# EAGLE design Plantemoji (EAGLE 9.6.2)
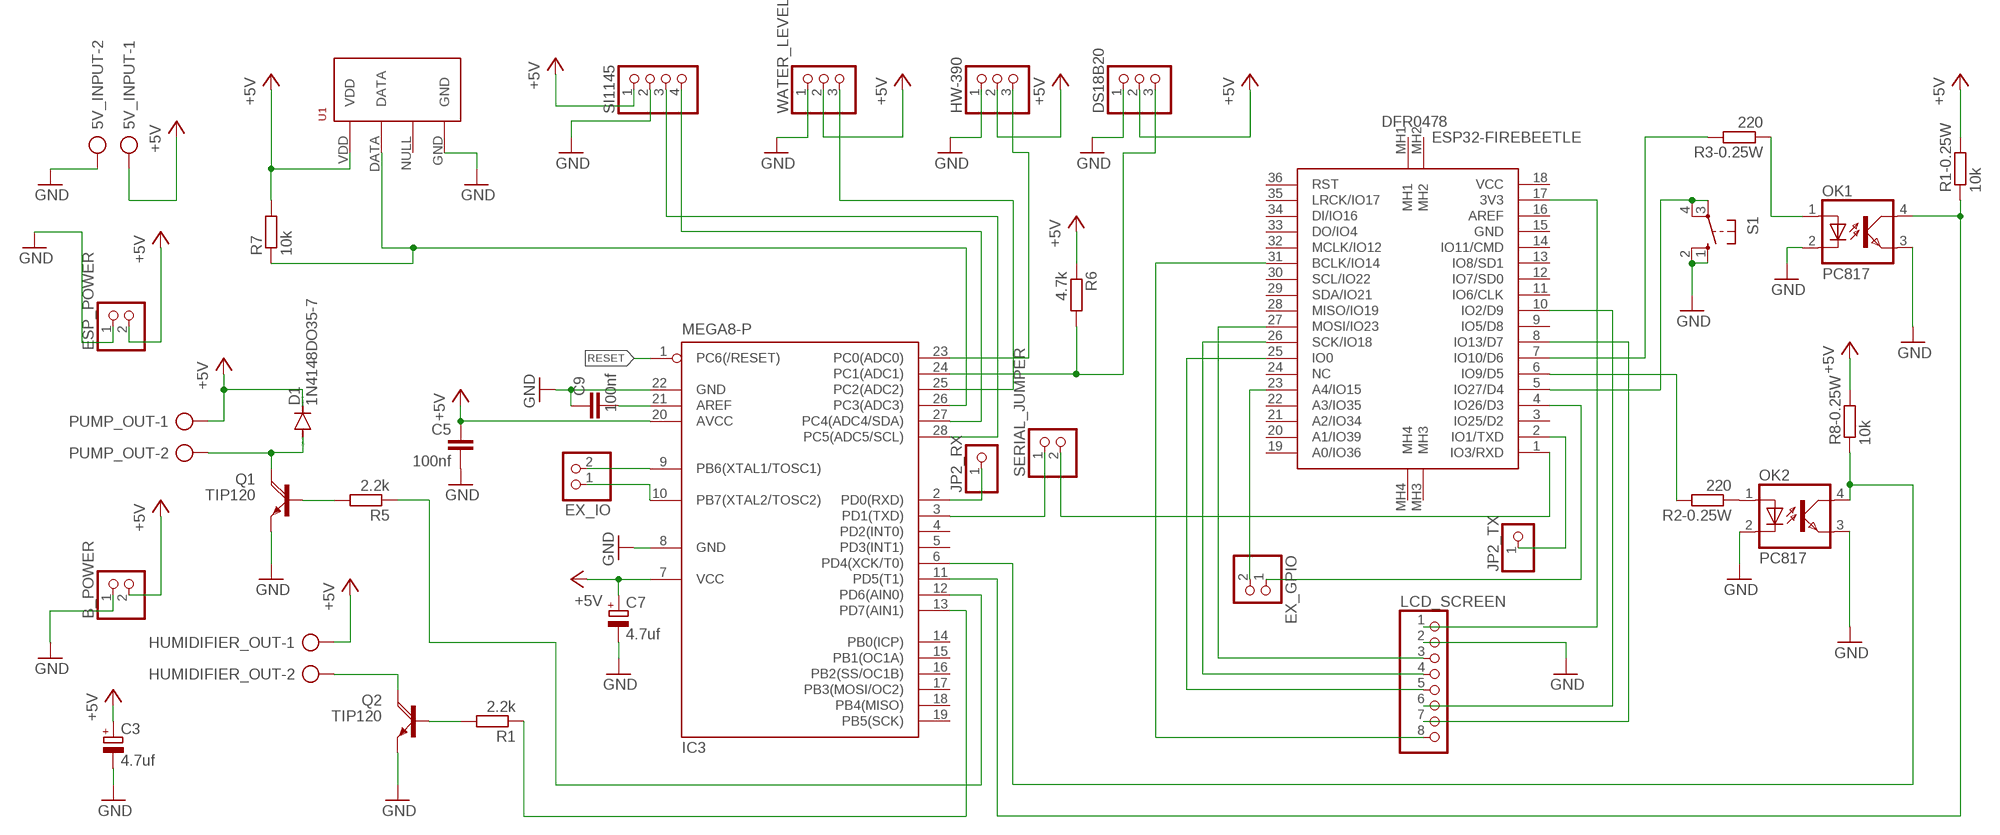
[diagram p0: schematic, sheet 1]

## Parts
5V_INPUT  AK500/2  [AK500/2]
B_POWER  PINHD-1X2  [1X02]
C3  4.7uf  CPOL-EUE2.5-5  [E2,5-5]
C5  100nf  C-EU025-025X050  [C025-025X050]
C7  4.7uf  CPOL-EUE2.5-5  [E2,5-5]
C9  100nf  C-EU025-025X050  [C025-025X050]
D1  1N4148DO35-7  [DO35-7]
DS18B20  PINHD-1X3  [1X03]
ESP32-FIREBEETLE  DFR0478  [FIREBEETLE_ESP32]
ESP_POWER  PINHD-1X2  [1X02]
EX_GPIO  PINHD-1X2  [1X02]
EX_IO  PINHD-1X2  [1X02]
HUMIDIFIER_OUT  AK500/2  [AK500/2]
HW-390  PINHD-1X3  [1X03]
IC3  MEGA8-P  [DIL28-3]
JP2_RX  PINHD-1X1  [1X01]
JP2_TX  PINHD-1X1  [1X01]
LCD_SCREEN  PINHD-1X8  [1X08]
OK1  PC817  [DIL04]
OK2  PC817  [DIL04]
PUMP_OUT  AK500/2  [AK500/2]
Q1  TIP120  [TO220AH]
Q2  TIP120  [TO220AH]
R1  2.2k  R-EU_0207/10  [0207/10]
R1-0.25W  10k  R-EU_0207/10  [0207/10]
R2-0.25W  220  R-EU_0207/10  [0207/10]
R3-0.25W  220  R-EU_0207/10  [0207/10]
R5  2.2k  R-EU_0207/10  [0207/10]
R6  4.7k  R-EU_0207/10  [0207/10]
R7  10k  R-EU_0207/10  [0207/10]
R8-0.25W  10k  R-EU_0207/10  [0207/10]
S1  10-XX  [B3F-10XX]
SERIAL_JUMPER  PINHD-1X2  [1X02]
SI1145  PINHD-1X4  [1X04]
U1  RHT03_DHT-22_AM2302  [RHT03_DHT-22]
WATER_LEVEL  PINHD-1X3  [1X03]

## Nets
+5V: 5V_INPUT.1 B_POWER.2 C3.+ C5.1 C7.+ D1.C DS18B20.2 ESP_POWER.2 HUMIDIFIER_OUT.1 HW-390.2 IC3.7(VCC) IC3.20(AVCC) PUMP_OUT.1 R1-0.25W.2 R6.1 R7.2 R8-0.25W.2 SI1145.1 U1.VDD WATER_LEVEL.2
GND: 5V_INPUT.2 B_POWER.1 C3.- C5.2 C7.- C9.2 DS18B20.1 ESP_POWER.1 HW-390.1 IC3.8(GND) IC3.22(GND) LCD_SCREEN.2 OK1.2(C) OK1.3(EMIT) OK2.2(C) OK2.3(EMIT) Q1.E Q2.E S1.1(S) S1.2(S1) SI1145.2 U1.GND WATER_LEVEL.1
N$2: ESP32-FIREBEETLE.5(IO27/D4) S1.3(P) S1.4(P1)
N$3: IC3.3(PD1(TXD)) SERIAL_JUMPER.1
N$4: ESP32-FIREBEETLE.1(IO3/RXD) SERIAL_JUMPER.2
N$5: ESP32-FIREBEETLE.17(3V3) LCD_SCREEN.1
N$6: ESP32-FIREBEETLE.27(MOSI/IO23) LCD_SCREEN.3
N$7: ESP32-FIREBEETLE.26(SCK/IO18) LCD_SCREEN.4
N$8: ESP32-FIREBEETLE.8(IO13/D7) LCD_SCREEN.7
N$9: ESP32-FIREBEETLE.25(IO0) LCD_SCREEN.5
N$10: ESP32-FIREBEETLE.10(IO2/D9) LCD_SCREEN.6
N$11: IC3.6(PD4(XCK/T0)) OK2.4(COL) R8-0.25W.1
N$12: OK2.1(A) R2-0.25W.1
N$13: ESP32-FIREBEETLE.6(IO9/D5) R2-0.25W.2
N$14: C9.1 IC3.21(AREF)
N$15: OK1.1(A) R3-0.25W.1
N$16: ESP32-FIREBEETLE.7(IO10/D6) R3-0.25W.2
N$17: IC3.2(PD0(RXD)) JP2_RX.1
N$18: ESP32-FIREBEETLE.2(IO1/TXD) JP2_TX.1
N$19: D1.A PUMP_OUT.2 Q1.C
N$20: Q1.B R5.2
N$21: IC3.12(PD6(AIN0)) R5.1
N$22: HUMIDIFIER_OUT.2 Q2.C
N$23: Q2.B R1.2
N$24: IC3.13(PD7(AIN1)) R1.1
N$25: HW-390.3 IC3.23(PC0(ADC0))
N$26: IC3.25(PC2(ADC2)) WATER_LEVEL.3
N$27: DS18B20.3 IC3.24(PC1(ADC1)) R6.2
N$28: IC3.26(PC3(ADC3)) R7.1 U1.DATA
N$29: IC3.28(PC5(ADC5/SCL)) SI1145.3
N$30: IC3.27(PC4(ADC4/SDA)) SI1145.4
N$31: ESP32-FIREBEETLE.31(BCLK/IO14) LCD_SCREEN.8
N$32: ESP32-FIREBEETLE.23(A4/IO15) EX_GPIO.2
N$33: EX_IO.2 IC3.9(PB6(XTAL1/TOSC1))
N$34: EX_IO.1 IC3.10(PB7(XTAL2/TOSC2))
N$35: ESP32-FIREBEETLE.4(IO26/D3) EX_GPIO.1
N$38: IC3.11(PD5(T1)) OK1.4(COL) R1-0.25W.1
RESET: IC3.1(PC6(/RESET))
Unconnected: ESP32-FIREBEETLE.3(IO25/D2) ESP32-FIREBEETLE.9(IO5/D8) ESP32-FIREBEETLE.11(IO6/CLK) ESP32-FIREBEETLE.12(IO7/SD0) ESP32-FIREBEETLE.13(IO8/SD1) ESP32-FIREBEETLE.14(IO11/CMD) ESP32-FIREBEETLE.15(GND) ESP32-FIREBEETLE.16(AREF) ESP32-FIREBEETLE.18(VCC) ESP32-FIREBEETLE.19(A0/IO36) ESP32-FIREBEETLE.20(A1/IO39) ESP32-FIREBEETLE.21(A2/IO34) ESP32-FIREBEETLE.22(A3/IO35) ESP32-FIREBEETLE.24(NC) ESP32-FIREBEETLE.28(MISO/IO19) ESP32-FIREBEETLE.29(SDA/IO21) ESP32-FIREBEETLE.30(SCL/IO22) ESP32-FIREBEETLE.32(MCLK/IO12) ESP32-FIREBEETLE.33(DO/IO4) ESP32-FIREBEETLE.34(DI/IO16) ESP32-FIREBEETLE.35(LRCK/IO17) ESP32-FIREBEETLE.36(RST) ESP32-FIREBEETLE.MH1 ESP32-FIREBEETLE.MH2 ESP32-FIREBEETLE.MH3 ESP32-FIREBEETLE.MH4 IC3.4(PD2(INT0)) IC3.5(PD3(INT1)) IC3.14(PB0(ICP)) IC3.15(PB1(OC1A)) IC3.16(PB2(SS/OC1B)) IC3.17(PB3(MOSI/OC2)) IC3.18(PB4(MISO)) IC3.19(PB5(SCK)) U1.NULL

## Library data of the parts
5V_INPUT HUMIDIFIER_OUT PUMP_OUT = con-ptr500:AK500/2: CONNECTOR; OC_FARNELL: unknown; OC_NEWARK: unknown
B_POWER ESP_POWER EX_GPIO EX_IO SERIAL_JUMPER = pinhead:PINHD-1X2: PIN HEADER
C3 C7 = rcl:CPOL-EU: POLARIZED CAPACITOR, European symbol
C5 C9 = rcl:C-EU: CAPACITOR, European symbol
D1 = diode:1N4148: DIODE high speed (Philips)
DS18B20 HW-390 WATER_LEVEL = pinhead:PINHD-1X3: PIN HEADER
ESP32-FIREBEETLE = DFR0478:DFR0478: Development Boards & Kits - Wireless FireBeetle ESP32 IOT MCU Source: Datasheet <https://datasheet.datasheetarchive.com/originals/distributors/DKDS-1/13356.pdf>; ARROW_PART_NUMBER: DFR0478; ARROW_PRICE-STOCK: https://www.arrow.com/en/products/dfr0478/dfrobot?region=nac; DESCRIPTION: Development Boards & Kits - Wireless FireBeetle ESP32 IOT MCU; HEIGHT: mm; MANUFACTURER_NAME: DFRobot; MANUFACTURER_PART_NUMBER: DFR0478; MOUSER_PART_NUMBER: 426-DFR0478; MOUSER_PRICE-STOCK: https://www.mouser.co.uk/ProductDetail/DFRobot/DFR0478?qs=EU6FO9ffTwc%252BR65h2NUGQw%3D%3D
IC3 = atmel:MEGA8-P: MICROCONTROLLER 8 Kbytes FLASH, 1 kbytes SRAM, 512 bytes EEPROM, USART, 4-channel 10 bit ADC, 2-channel 8 bit ADC Pin compatible with Atmega48, ATMega88, ATMega168 Source: avr.lbr; OC_FARNELL: unknown; OC_NEWARK: unknown
JP2_RX JP2_TX = pinhead:PINHD-1X1: PIN HEADER
LCD_SCREEN = pinhead:PINHD-1X8: PIN HEADER
OK1 OK2 = optocoupler:PC817: SHARP OPTO COUPLER; MPN: PC817X4J000F; OC_FARNELL: 9707727; OC_NEWARK: 97K7059
Q1 Q2 = transistor-power:TIP120: NPN DARLINGTON TRANSISTOR
R1 R1-0.25W R2-0.25W R3-0.25W R5-R7 R8-0.25W = rcl:R-EU_: RESISTOR, European symbol
S1 = switch-omron:10-XX: OMRON SWITCH; MPN: B3F-1000; OC_FARNELL: 176432; OC_NEWARK: 36M3542
SI1145 = pinhead:PINHD-1X4: PIN HEADER
U1 = RHT03_DHT-22_AM2302:RHT03_DHT-22_AM2302: RHT03 / DHT-22 / AM2302 Packages and symbol for the RHT03 / DHT-22 relative humidity and temperature sensor. Note: The AM2302 is a wired version of the DHT-22 which typically requires less clearance and is thus provided as a separate package.; PROD_ID: SEN-10167

## Net classes
0 default: width 0.61 mm, clearance 0.406 mm
1 power: width 1.016 mm, clearance 0.406 mm

## Board
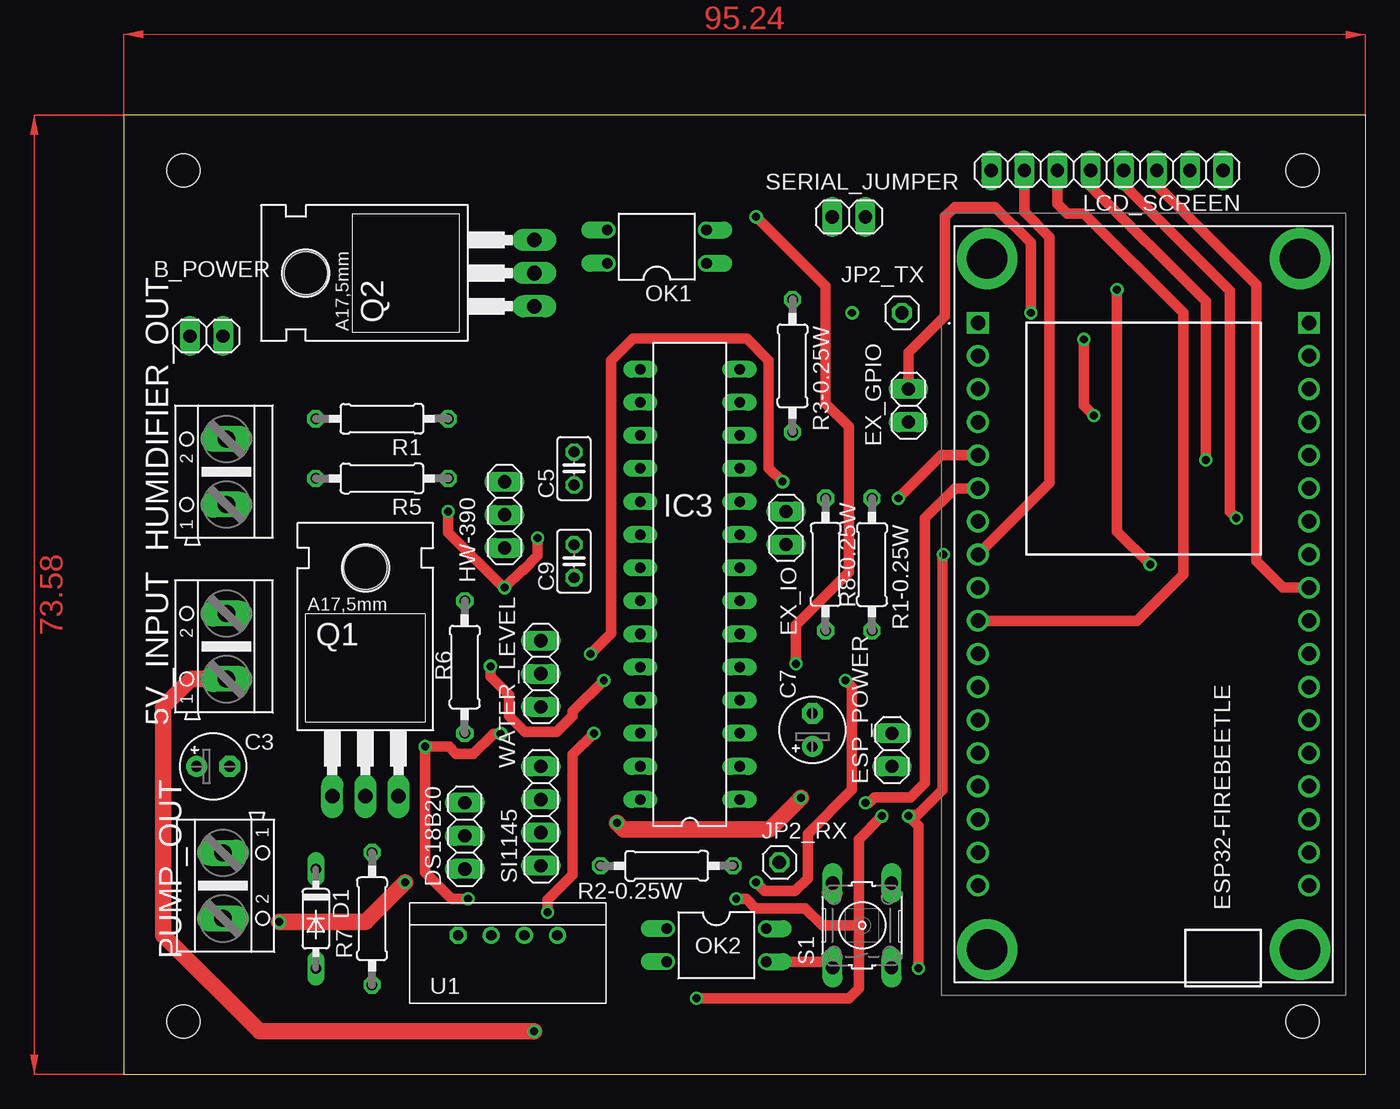
[diagram p1: board, top side]
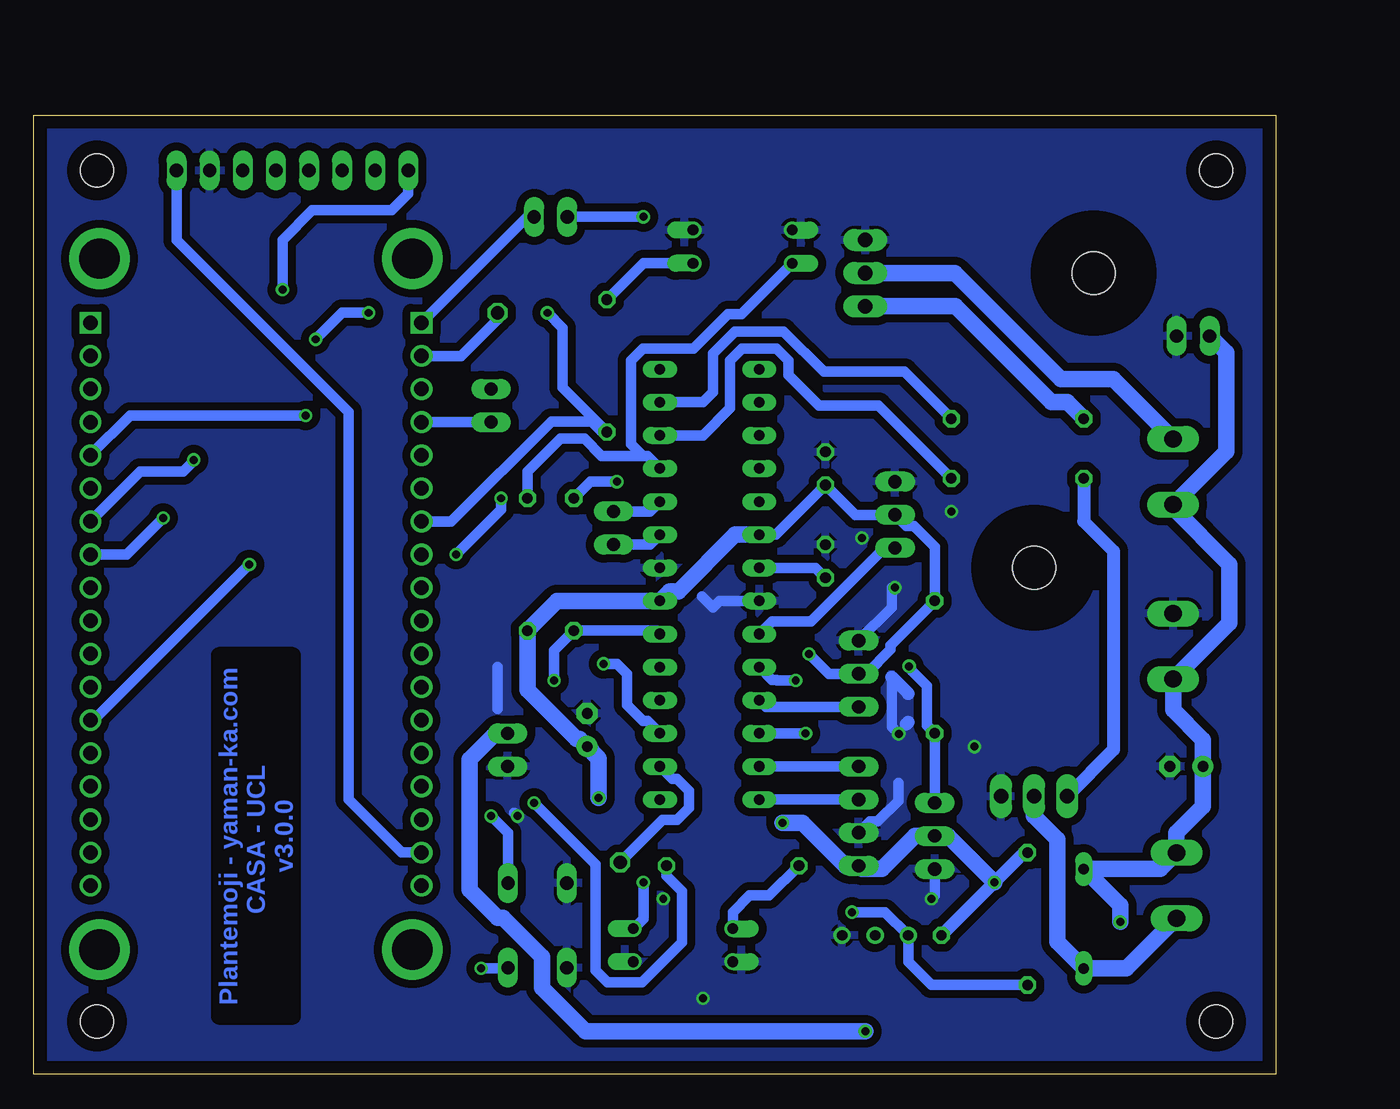
[diagram p2: board, bottom side, seen from below]

Size 95.27 x 73.58 mm. Coordinates in mm from the lower left corner, seen from the top.
Outline: 0,0 95.27,0 95.27,73.58 0,73.58 0,0
Copper layers (1*16): Top 0.035mm / dielectric 1.5mm / Bottom 0.035mm
Design rules "default *": minimum track width 24mil, minimum drill 24mil, track to track 20mil, track to pad 20mil, pad to pad 20mil, via to via 20mil, smd to smd 8mil, copper to edge 40mil, drill to drill 8mil, minimum pad ring 10mil, minimum via ring 8mil, stop-mask expansion 4mil, vias tented up to drill 0mil, thermal gap 10mil
Holes 2.54 mm at 4.57,69.34 4.57,4.06 90.42,4.06 90.42,69.34

### Footprints (pad centres in the part's own frame; a part is rotated, then mirrored left to right if it is on the bottom)
AK500/2 = drill 1.321 long: 1 -2.515,0; 2 2.515,0
1X02 = drill 1.016 long: 1 -1.27,0; 2 1.27,0
E2,5-5 = drill 0.813 pad 1.6: + -1.27,0 | drill 0.813 pad 1.6 octagon: - 1.27,0
C025-025X050 = drill 0.813 octagon: 1 -1.27,0; 2 1.27,0
DO35-7 = drill 0.813 long: A 3.81,0; C -3.81,0
1X03 = drill 1.016 long: 1 -2.54,0; 2 0,0; 3 2.54,0
FIREBEETLE_ESP32 = drill 1.11 pad 1.665 square: 1 25.4,12.7; 19 25.4,-12.7 | drill 1.11 pad 1.665: 2 22.86,12.7; 3 20.32,12.7; 4 17.78,12.7; 5 15.24,12.7; 6 12.7,12.7; 7 10.16,12.7; 8 7.62,12.7; 9 5.08,12.7; 10 2.54,12.7; 11 0,12.7; 12 -2.54,12.7; 13 -5.08,12.7; 14 -7.62,12.7; 15 -10.16,12.7; 16 -12.7,12.7; 17 -15.24,12.7; 18 -17.78,12.7; 20 22.86,-12.7; 21 20.32,-12.7; 22 17.78,-12.7; 23 15.24,-12.7; 24 12.7,-12.7; 25 10.16,-12.7; 26 7.62,-12.7; 27 5.08,-12.7; 28 2.54,-12.7; 29 0,-12.7; 30 -2.54,-12.7; 31 -5.08,-12.7; 32 -7.62,-12.7; 33 -10.16,-12.7; 34 -12.7,-12.7; 35 -15.24,-12.7; 36 -17.78,-12.7 | drill 3.1 pad 4.65: MH1 -22.677,-12; MH2 -22.677,12; MH3 30.323,12; MH4 30.323,-12
DIL28-3 = drill 0.813 long: 1 -16.51,-3.81; 2 -13.97,-3.81; 3 -11.43,-3.81; 4 -8.89,-3.81; 5 -6.35,-3.81; 6 -3.81,-3.81; 7 -1.27,-3.81; 8 1.27,-3.81; 9 3.81,-3.81; 10 6.35,-3.81; 11 8.89,-3.81; 12 11.43,-3.81; 13 13.97,-3.81; 14 16.51,-3.81; 15 16.51,3.81; 16 13.97,3.81; 17 11.43,3.81; 18 8.89,3.81; 19 6.35,3.81; 20 3.81,3.81; 21 1.27,3.81; 22 -1.27,3.81; 23 -3.81,3.81; 24 -6.35,3.81; 25 -8.89,3.81; 26 -11.43,3.81; 27 -13.97,3.81; 28 -16.51,3.81
1X01 = drill 1.016 octagon: 1 0,0
1X08 = drill 1.016 long: 1 -8.89,0; 2 -6.35,0; 3 -3.81,0; 4 -1.27,0; 5 1.27,0; 6 3.81,0; 7 6.35,0; 8 8.89,0
DIL04 = drill 0.813 offset: 1 -1.27,-3.81; 2 1.27,-3.81; 3 1.27,3.81; 4 -1.27,3.81
TO220AH = drill 1.118 long: B -2.54,-6.35; C 0,-6.35; E 2.54,-6.35 | hole 3.302: 0,11.176
0207/10 = drill 0.813 octagon: 1 -5.08,0; 2 5.08,0
B3F-10XX = drill 1.016 long: 1 -3.251,2.261; 2 3.251,2.261; 3 -3.251,-2.261; 4 3.251,-2.261
1X04 = drill 1.016 long: 1 -3.81,0; 2 -1.27,0; 3 1.27,0; 4 3.81,0
RHT03_DHT-22 = drill 0.8: DATA -1.27,0; GND 3.81,0; NULL 1.27,0 | drill 0.8 octagon: VDD -3.81,0

### Placement (x,y rotation side)
5V_INPUT  7.87,32.84 90 top
B_POWER  6.35,56.64 180 top
C3  6.86,23.62 0 top
C5  34.54,46.48 90 top
C7  52.83,26.42 90 top
C9  34.54,39.37 90 top
D1  14.73,11.94 270 top
DS18B20  26.16,18.29 90 top
ESP32-FIREBEETLE  78.23,32.26 90 top
ESP_POWER  58.93,24.89 90 top
EX_GPIO  60.2,51.31 90 top
EX_IO  50.8,41.91 270 top
HUMIDIFIER_OUT  7.87,46.23 90 top
HW-390  29.21,42.93 270 top
IC3  43.43,37.59 90 top
JP2_RX  50.29,16.26 0 top
JP2_TX  59.69,58.42 0 top
LCD_SCREEN  75.44,69.34 180 top
OK1  40.89,63.5 90 top
OK2  45.47,9.91 270 top
PUMP_OUT  7.62,14.48 270 top
Q1  18.54,27.69 0 top
Q2  25.15,61.47 90 top
R1  19.81,50.29 180 top
R1-0.25W  57.4,39.12 270 top
R2-0.25W  41.66,16 0 top
R3-0.25W  51.31,54.36 270 top
R5  19.81,45.72 180 top
R6  26.16,31.24 270 top
R7  19.05,11.94 90 top
R8-0.25W  53.85,39.12 90 top
S1  56.64,11.43 90 top
SERIAL_JUMPER  55.63,65.79 0 top
SI1145  32,19.81 90 top
U1  29.46,10.67 0 top
WATER_LEVEL  32,30.73 270 top

### Tracks (layer width: path | path; a pad name or v marks a point on that pad's centre or on a via)
+5V  (via drill 0.61)
  Top 0.813: v35.81,32.26 37.39,33.83 37.39,54.75 39.07,56.44 47.8,56.44 49.48,54.75 49.48,46.53 v50.55,45.47
  Top 1.27: v11.94,11.68 18.54,11.68 v21.59,14.73 | v37.85,19.3 38.35,18.8 49.53,18.8 v51.94,21.21 | 5V_INPUT.1 5.18,30.33 3.05,28.19 3.05,10.67 10.41,3.3 v31.5,3.3
  Bottom 0.813: IC3.20 38.35,41.4 C5.1 32.26,42.93 HW-390.2 28.35,42.06 27.75,42.06 26.16,40.47 R6.1 29.57,32.92 29.57,32.58 31.41,30.73 WATER_LEVEL.2 34.29,30.73 v35.81,32.26 | v50.55,45.47 52.58,45.47 R8-0.25W.2
  Bottom 1.016: U1.VDD v21.59,14.73 19.3,17.02 R7.2
  Bottom 1.27: v11.94,11.68 11.94,12.95 D1.C 8.87,15.75 PUMP_OUT.1 7.62,18.54 5.59,20.57 C3.+ 5.59,25.65 7.87,27.94 5V_INPUT.1 3.56,34.65 3.56,39.12 7.87,43.43 HUMIDIFIER_OUT.1 3.81,47.78 3.81,55.37 B_POWER.2 | v21.59,14.73 25.15,18.29 DS18B20.2 27.69,18.29 30.23,15.75 31.75,15.75 SI1145.1 33.02,16 36.32,19.3 v37.85,19.3 | v51.94,21.21 51.94,24.26 C7.+ 53.43,25.74 53.64,25.74 57.4,29.51 R1-0.25W.2 55.12,36.32 IC3.7 46.51,37.06 45.84,37.06 41.49,41.4 IC3.20 | v31.5,3.3 52.96,3.3 56.29,6.63 56.29,9.02 59.28,12.01 59.69,12.01 61.85,14.17 61.85,24.16 59.84,26.16 ESP_POWER.2
GND  (via drill 0.61)
  Top 0.813: v24.89,43.18 24.89,41.57 29.12,37.34 v29.21,37.34 30.58,38.71 30.67,38.71 31.75,39.79 v31.75,41.15 | v28.92,26.13 28.36,26.13 26.81,24.59 25.51,24.59 24.95,25.15 v23.11,25.15 23.11,15.49 25.15,13.46 v26.42,13.46 | v58.17,19.81 56.39,18.03 56.39,11.43 | v43.94,5.84 55.63,5.84 56.39,6.6 56.39,11.43 | 56.39,11.43 53.59,11.43 52.27,12.75 48.48,12.75 47.77,13.46 v46.99,13.46 | OK2.3 53.92,8.64 S1.1
  Bottom 0.813: 59.69,28.03 59.69,31.24 | WATER_LEVEL.1 29.46,35.81 29.46,37.34 v29.21,37.34 | 29.46,30.48 29.46,26.67 v28.92,26.13 | SI1145.2 31.14,19.41 30.55,19.41 28.96,21 28.96,22.35 | DS18B20.1 26.16,13.72 v26.42,13.46 | IC3.22 42.67,36.32 43.18,35.81 44.03,36.67 | 58.42,20.07 v58.17,19.81
  Bottom 1.016: 28.35,26.86 28.19,27.01 | 28.19,29.21 29.46,30.48
  pour Bottom (isolate 0.61): 0.15,73.82 95.24,73.55 94.97,-0.21 -0.12,0.06
N$2  (via drill 0.61)
  Top 0.813: v60.96,8.13 60.96,19.05 v60.2,19.81 60.3,19.91 60.9,19.91 62.79,21.8 62.79,39.88 v62.89,39.88 | v59.44,44.2 62.74,47.5 ESP32-FIREBEETLE.5
  Bottom 0.813: S1.4 58.9,18.52 v60.2,19.81 | v60.96,8.13 58.95,8.13 S1.3 | v62.89,39.88 59.44,43.33 v59.44,44.2
N$3  (via drill 0.61)
  Top 0.813: v51.56,31.5 51.56,34.48 55.63,38.55 55.63,49.7 53.85,51.48 53.85,60.45 v48.51,65.79
  Bottom 0.813: IC3.3 48.21,27.13 48.56,27.13 49.78,28.35 49.78,30.73 50.55,31.5 v51.56,31.5 | v48.51,65.79 SERIAL_JUMPER.1
N$4
  Bottom 0.813: SERIAL_JUMPER.2 57.4,65.79 ESP32-FIREBEETLE.1
N$5
  Bottom 0.813: ESP32-FIREBEETLE.17 67.06,17.02 71.12,21.08 71.12,50.8 84.33,64.01 LCD_SCREEN.1
N$6
  Top 0.813: ESP32-FIREBEETLE.27 88.9,37.34 86.87,39.37 86.87,60.6 79.25,68.22 LCD_SCREEN.3
N$7  (via drill 0.61)
  Top 0.813: v85.34,42.67 84.84,43.18 84.84,60.11 76.71,68.24 LCD_SCREEN.4
  Bottom 0.813: v85.34,42.67 88.14,39.88 ESP32-FIREBEETLE.26
N$8
  Top 0.813: LCD_SCREEN.7 69.09,66.17 71.02,64.24 71.02,45.36 70.87,45.21 ESP32-FIREBEETLE.8
N$9  (via drill 0.61)
  Top 0.813: v83.01,47.14 83.01,59.31 74.17,68.15 LCD_SCREEN.5
  Bottom 0.813: ESP32-FIREBEETLE.25 87.12,46.23 83.82,46.23 83.01,47.04 v83.01,47.14
N$10
  Top 0.813: ESP32-FIREBEETLE.10 77.72,34.8 81.28,38.35 81.28,58.42 73.66,66.04 72.39,66.04 71.63,66.8 LCD_SCREEN.6
N$11  (via drill 0.61)
  Top 0.813: v55.37,30.23 55.88,29.72 55.88,21.84 52.48,18.44 52.48,15.05 51.49,14.07 49.17,14.07 v48.51,14.73
  Bottom 0.813: IC3.6 47.5,34.04 R8-0.25W.1 55.37,32.51 v55.37,30.23 | v48.51,14.73 48.51,11.94 OK2.4
N$12
  Bottom 0.813: OK2.1 41.66,12.45 40.39,13.72 38.86,13.72 R2-0.25W.1
N$13  (via drill 0.61)
  Top 0.813: v56.9,20.83 57.17,20.83 57.58,21.23 60.35,21.23 61.47,22.35 61.47,42.67 63.75,44.96 ESP32-FIREBEETLE.6
  Bottom 0.813: R2-0.25W.2 46.74,15.22 45.57,14.05 45.57,10.12 48.62,7.06 51.25,7.06 52.17,7.98 52.17,16.1 v56.9,20.83
N$14
  Bottom 0.813: IC3.21 35.31,38.86 C9.1
N$15
  Bottom 0.813: R3-0.25W.1 48.51,62.23 OK1.1
N$16  (via drill 0.61)
  Bottom 0.813: v55.88,58.42 54.71,57.25 54.71,52.68 R3-0.25W.2 51.67,49.28 52.48,50.09 55.58,50.09 63.25,42.42 ESP32-FIREBEETLE.7
N$17
  Bottom 0.813: IC3.2 46.28,22.66 45.93,22.66 45.01,21.73 45.01,20.43 45.93,19.51 47.04,19.51 JP2_RX.1
N$18
  Bottom 0.813: JP2_TX.1 59.69,57.91 62.48,55.12 ESP32-FIREBEETLE.2
N$19
  Bottom 1.27: PUMP_OUT.2 11.45,8.13 D1.A 16.76,10.16 16.76,18.03 18.54,19.81 Q1.C
N$20
  Bottom 1.016: R5.2 14.73,42.42 12.45,40.13 12.45,24.89 Q1.B
N$21
  Bottom 0.813: R5.1 30.48,51.31 35.05,51.31 37.39,53.64 37.39,54.75 38.31,55.68 40.94,55.68 41.86,54.75 41.86,51.11 43.94,49.02 IC3.12
N$22
  Bottom 1.27: HUMIDIFIER_OUT.2 12.47,53.34 16.48,53.34 24.61,61.47 Q2.C
N$23
  Bottom 1.27: R1.2 16,51.56 17.21,51.56 24.58,58.93 Q2.B
N$24
  Bottom 0.813: IC3.13 43.94,51.56 43.18,52.32 43.18,55.3 41.48,57 37.76,57 34.66,53.9 28.5,53.9 R1.1
N$25
  Bottom 0.813: IC3.23 38.66,34.75 35.67,34.75 30.03,40.39 HW-390.3
N$26
  Bottom 0.813: WATER_LEVEL.3 39.12,28.19 IC3.25
N$27  (via drill 0.61)
  Top 0.813: v36.83,30.23 34.44,27.84 34.44,27.5 33.21,26.26 30.8,26.26 29.57,27.5 29.57,29.11 28.13,30.54 v28.13,31.3
  Bottom 0.813: IC3.24 38.66,30.28 38.31,30.28 38.26,30.23 v36.83,30.23 | v28.13,31.3 28.13,31.16 26.77,29.8 26.77,26.77 R6.2 DS18B20.3
N$28  (via drill 0.61)
  Top 0.813: v32.51,12.45 32.51,13.38 34.44,15.31 34.44,24.54 v36.07,26.16
  Bottom 0.813: R7.1 26.42,6.86 28.19,8.64 U1.DATA 29.97,12.45 v32.51,12.45 | v36.07,26.16 IC3.26
N$29
  Bottom 0.813: SI1145.3 IC3.28
N$30
  Bottom 0.813: SI1145.4 IC3.27
N$31  (via drill 0.61)
  Top 0.813: v76.2,60.2 76.2,41.66 v78.74,39.12
  Bottom 0.813: v78.74,39.12 90.68,27.18 ESP32-FIREBEETLE.31 | v76.2,60.2 76.2,64.01 73.91,66.29 67.82,66.29 66.55,67.56 LCD_SCREEN.8
N$32  (via drill 0.61)
  Top 0.813: EX_GPIO.2 60.2,55.37 62.99,58.17 62.99,65.79 63.75,66.55 66.85,66.55 69.6,63.8 v69.6,58.42 | v73.66,56.39 73.66,51.31 v74.42,50.55
  Bottom 0.813: v69.6,58.42 71.63,58.42 v73.66,56.39 | v74.42,50.55 87.88,50.55 ESP32-FIREBEETLE.23
N$33
  Bottom 0.813: EX_IO.2 48.01,40.64 IC3.9
N$34
  Bottom 0.813: EX_IO.1 48.01,43.18 IC3.10
N$35
  Bottom 0.813: EX_GPIO.1 ESP32-FIREBEETLE.4
N$38
  Bottom 0.813: 48.56,47.45 49.48,48.37 49.48,54.75 48.56,55.68 44.67,55.68 42.03,58.32 41,58.32 OK1.4 | IC3.11 48.21,47.45 48.56,47.45 | 48.56,47.45 51.71,47.45 53.03,48.77 54.86,48.77 57.4,46.23 R1-0.25W.1
(copper drawn outside any net)
  shapes: Top area x2

### Text on the board
Bottom: Plantemoji - yaman-ka.com / CASA - UCL / v3.0.0